# Altium schematic sheet synchronous.SchDoc
size A4; SheetNumber: 3; SheetTotal: 6
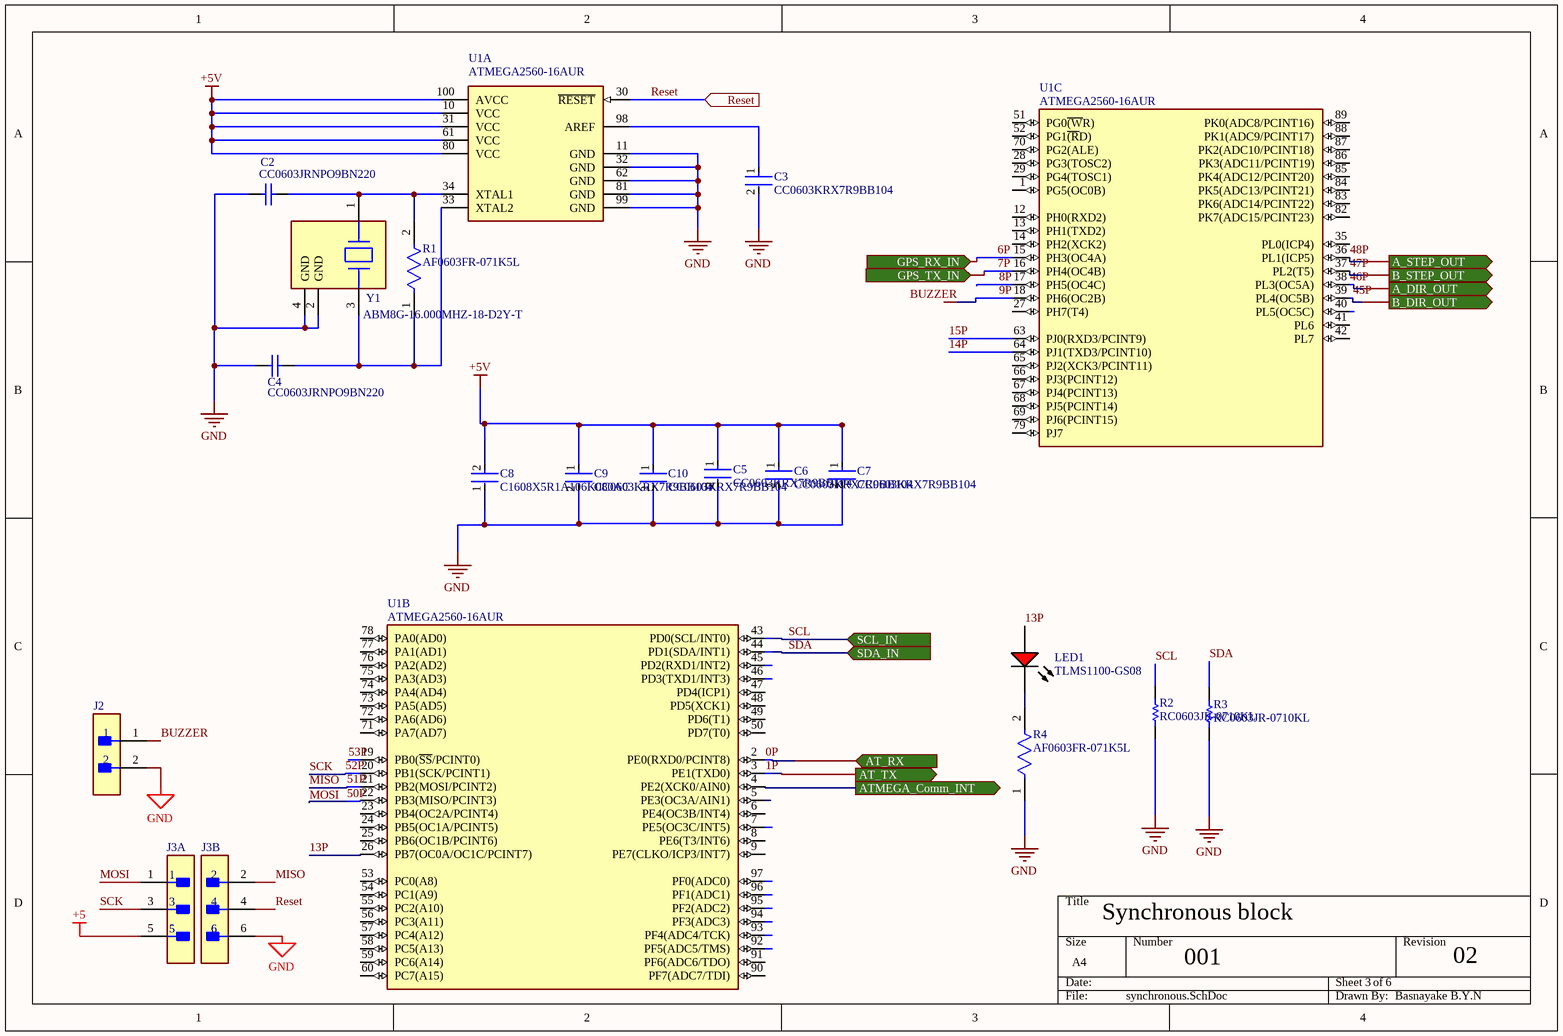
[diagram p0: synchronous.SchDoc]

## Parts
C2  CC0603JRNPO9BN220  [CAPC1608X90X40LL10T20]
C3  CC0603KRX7R9BB104  [FP-CC0603-DA-MFG]
C4  CC0603JRNPO9BN220  [CAPC1608X90X40LL10T20]
C5  CC0603KRX7R9BB104  [FP-CC0603-DA-MFG]
C6  CC0603KRX7R9BB104  [FP-CC0603-DA-MFG]
C7  CC0603KRX7R9BB104  [FP-CC0603-DA-MFG]
C8  C1608X5R1A106K080AC  [FP-C1608-080-0_1-MFG]
C9  CC0603KRX7R9BB104  [FP-CC0603-DA-MFG]
C10  CC0603KRX7R9BB104  [FP-CC0603-DA-MFG]
J2  B2B-XH-A(LF)(SN)  [FP-B2B-XH-A_LF_SN-MFG]  (value not drawn)
J3  M20-9980346  [FP-M20-9980346-MFG]  (value not drawn)  (parts A,B of 2)
LED1  TLMS1100-GS08  [VISH-TLMX1100_V]
R1  AF0603FR-071K5L  [FP-AF0603-IPC_B]
R2  RC0603JR-0710KL  [RESC1608X55X25ML10T15]
R3  RC0603JR-0710KL  [RESC1608X55X25ML10T15]
R4  AF0603FR-071K5L  [FP-AF0603-IPC_B]
U1  ATMEGA2560-16AUR  [FP-100A-MFG]  (parts A,B,C of 3)
Y1  ABM8G-16.000MHZ-18-D2Y-T  [FP-ABM8G-MFG]

## Ports
A_DIR_OUT (out, see Top_domain[3B]), A_STEP_OUT (out, see Top_domain[3B]), AT_RX (in, see Top_domain[2B]), AT_TX (out, see Top_domain[3B]), ATMEGA_Comm_INT (out, see Top_domain[2B]), B_DIR_OUT (out, see Top_domain[3B]), B_STEP_OUT (out, see Top_domain[3B]), GPS_RX_IN (in, see Top_domain[2B]), GPS_TX_IN (in, see Top_domain[2B]), Reset (in), SCL_IN (in, see Top_domain[2B]), SDA_IN (in, see Top_domain[2B])

## Nets
+5: J3.5
+5V: C5.1 C6.1 C7.1 C8.2 C9.1 C10.1 U1.10(VCC) U1.31(VCC) U1.61(VCC) U1.80(VCC) U1.100(AVCC)
GND: C2.1 C3.2 C4.1 C5.2 C6.2 C7.2 C8.1 C9.2 C10.2 J2.2 J3.6 R2.1 R3.1 R4.1 U1.11(GND) U1.32(GND) U1.62(GND) U1.81(GND) U1.99(GND) Y1.2(GND) Y1.4(GND)
0P: U1.2(PE0(RXD0/PCINT8)) ; port AT_RX
1P: U1.3(PE1(TXD0)) ; port AT_TX
6P: U1.15(PH3(OC4A)) ; port GPS_RX_IN
7P: U1.16(PH4(OC4B)) ; port GPS_TX_IN
8P: U1.17(PH5(OC4C))
9P: U1.18(PH6(OC2B))
13P: LED1.1(A) U1.26(PB7(OC0A/OC1C/PCINT7))
14P: U1.64(PJ1(TXD3/PCINT10))
15P: U1.63(PJ0(RXD3/PCINT9))
45P: U1.39(PL4(OC5B)) ; port B_DIR_OUT
46P: U1.38(PL3(OC5A)) ; port A_DIR_OUT
47P: U1.37(PL2(T5)) ; port B_STEP_OUT
48P: U1.36(PL1(ICP5)) ; port A_STEP_OUT
50P: J3.1 U1.22(PB3(MISO/PCINT3))  [also labelled MOSI]
51P: J3.2 U1.21(PB2(MOSI/PCINT2))  [also labelled MISO]
52P: J3.3 U1.20(PB1(SCK/PCINT1))  [also labelled SCK]
53P: U1.19(PB0(~{SS}/PCINT0))
ATMEGA_Comm_INT: U1.4(PE2(XCK0/AIN0)) ; port ATMEGA_Comm_INT
BUZZER: J2.1
Reset: J3.4 U1.30(~{RESET}) ; port Reset
SCL: R2.2 U1.43(PD0(SCL/INT0)) ; port SCL_IN
SDA: R3.2 U1.44(PD1(SDA/INT1)) ; port SDA_IN
NetC2_2: C2.2 R1.2 U1.34(XTAL1) Y1.1
NetC3_1: C3.1 U1.98(AREF)
NetC4_2: C4.2 R1.1 U1.33(XTAL2) Y1.3
NetLED1_2: LED1.2(K) R4.2

Not connected (* = marked no-connect by the designer): U1 1(PG5(OC0B)) 5(PE3(OC3A/AIN1)) 6(PE4(OC3B/INT4)) 7(PE5(OC3C/INT5)) 8(PE6(T3/INT6)) 9(PE7(CLKO/ICP3/INT7)) 12(PH0(RXD2)) 13(PH1(TXD2)) 14(PH2(XCK2)) 23(PB4(OC2A/PCINT4)) 24(PB5(OC1A/PCINT5)) 25(PB6(OC1B/PCINT6)) 27(PH7(T4)) 28(PG3(TOSC2)) 29(PG4(TOSC1)) 35(PL0(ICP4)) 40(PL5(OC5C)) 41(PL6) 42(PL7) 45(PD2(RXD1/INT2)) 46(PD3(TXD1/INT3)) 47(PD4(ICP1)) 48(PD5(XCK1)) 49(PD6(T1)) 50(PD7(T0)) 51(PG0~{(W}R)) 52(PG1~{(R}D)) 53(PC0(A8)) 54(PC1(A9)) 55(PC2(A10)) 56(PC3(A11)) 57(PC4(A12)) 58(PC5(A13)) 59(PC6(A14)) 60(PC7(A15)) 65(PJ2(XCK3/PCINT11)) 66(PJ3(PCINT12)) 67(PJ4(PCINT13)) 68(PJ5(PCINT14)) 69(PJ6(PCINT15)) 70(PG2(ALE)) 71(PA7(AD7)) 72(PA6(AD6)) 73(PA5(AD5)) 74(PA4(AD4)) 75(PA3(AD3)) 76(PA2(AD2)) 77(PA1(AD1)) 78(PA0(AD0)) 79(PJ7) 82(PK7(ADC15/PCINT23)) 83(PK6(ADC14/PCINT22)) 84(PK5(ADC13/PCINT21)) 85(PK4(ADC12/PCINT20)) 86(PK3(ADC11/PCINT19)) 87(PK2(ADC10/PCINT18)) 88(PK1(ADC9/PCINT17)) 89(PK0(ADC8/PCINT16)) 90(PF7(ADC7/TDI)) 91(PF6(ADC6/TDO)) 92(PF5(ADC5/TMS)) 93(PF4(ADC4/TCK)) 94(PF3(ADC3)) 95(PF2(ADC2)) 96(PF1(ADC1)) 97(PF0(ADC0))

## Notes on the sheet
- Synchronous block
- 001
- 3
- 6
- 02
- Basnayake B.Y.N
- Labels drawn without touching a wire or pin: BUZZER

## Library data of the parts
C2 C4 = CMP-1659-00026-1: Chip Capacitor, 22 pF, +/- 5%, 50 V, -55 to 125 degC, 0603 (1608 Metric), RoHS, Tape and Reel; ComponentLink1URL: http://www.yageo.com/; PackageReference: 0603; ComponentLink1Description: Manufacturer URL; PackageDescription: 2-Pin Surface Mount Device, Body 1.6 x 0.8 mm; DatasheetVersion: Rev. 8, 08/2011; ComponentLink2Description: Datasheet; ComponentLink2URL: http://www.yageo.com/documents/recent/UPY-GP_NP0_16V-to-50V_8.pdf
C3 C5-C7 C9 C10 = CMP-2100-03601-2: CAP CER 0.1UF 50V X7R 0603; Manufacturer: YAGEO; Material: Ceramic; Capacitance: 100 nF; Temperature Coefficient: 15%; Tolerance: 0.1; Value: 100 nF; Height: 0.9mm; Voltage: 50 V; ComponentLink2Description: Datasheet; Device Class L2: Capacitors; Temperature Range High: +125°C; Category: Cap; Footprint Url: http://www.yageo.com/exep/pages/download/literatures/UPY-C_GEN_24.pdf; ComponentLink2URL: http://www.yageo.com/documents/recent/UPY-GPHC_X7R_6.3V-to-50V_18.pdf; Package: CC0603-DA; Temperature: -55°C to +125°C; Voltage Rating: 50 V; Temperature Characteristic: X7R; Device Class L1: Passive Components; Temperature Range Low: -55°C; Manufacturer Part Number: CC0603KRX7R9BB104; RoHS: TRUE; Automotive: No; Device Class L3: Ceramic Capacitors; Octopart: https://octopart.com/cc0603krx7r9bb104-yageo-42244635; Mouser Description: Multilayer Ceramic Capacitor, CC Series, 0.1 - F, - 10%, X7R, 50 V, 0603 [1608 Metric]; Lead Free: Yes; Digikey Description: CAP CER 0.1UF 50V X7R 0603
C8 = CMP-2000-04979-3: Multilayer Ceramic Capacitors 10μF ±10% 10V X5R SMD 0603; Capacitance: 10uF; Dielectric Material: Ceramic; Construction: Flat; Height: 0.8mm; Thickness: 0.035inch; Case Code (Metric): 1608; Radiation Hardening: No; Number of Pins: 2; Voltage Rating (DC): 10V; Depth: 0.8mm; Voltage: 10V; RoHS Compliant: Yes; Voltage Rating: 10V; Package Quantity: 1; Resistor Type: Ceramic; Termination: SMD/SMT; Lead Free: Lead Free; REACH SVHC: No SVHC; Tolerance: 10%; Mount: Surface Mount; Series: C; Packaging: Tape and Reel; Width: 0.8mm; Dielectric: X5R; Weight: 7.1E-05oz; Length: 1.6mm; Max Operating Temperature: 85°C; Case Code (Imperial): 0603; Case/Package: 0603; Min Operating Temperature: -55°C
J2 = CMP-2000-05888-3: CONN HEADER VERT 2POS 2.5MM; Current Rating: 3A; Voltage Rating: 250V; Number of Contacts: 2; Contact Resistance: 20mR; Wire/Cable Gauge: 22AWG; Insulation Resistance: 1GR; Connector Type: Male Pin; Packaging: Bulk; Contact Material: Brass; Lead Free: Lead Free; Orientation: Straight; Contact Plating: Tin; Max Current Rating: 3A; Termination: Solder; Fastening Type: Detent; Depth: 5.75mm; Housing Material: Polyamide; REACH SVHC: No SVHC; Series: XH; Voltage Rating (AC): 250V; Number of Positions: 2; Color: Natural; Contact Type: Male Pin; Max Voltage Rating (DC): 250V; Pitch: 2.5mm; Lead Pitch: 2.5mm; Mount: Through Hole; Max Operating Temperature: 85°C; Length: 7.4mm; Max Voltage Rating (AC): 250V; Min Operating Temperature: -25°C; Number of Rows: 1; Housing Color: White
J3 = CMP-2000-06636-2: CONN HEADER VERT 6POS 2.54MM; Manufacturer: Harwin; Current Rating: 3A; Number Of Contacts: 6; Conn Gender: Male; Conn Orientation: Vertical; Device Class L1: Connectors; ComponentLink2Description: Datasheet; Height: 8.99mm; Temperature Range High: +105°C; Contact Material: Tin,Nickel; RoHS: TRUE; Temperature Range Low: -40°C; ComponentLink2URL: https://cdn.harwin.com/pdfs/M20-998.pdf; Digikey Description: CONN HEADER VERT 6POS 2.54MM; Pitch: 2.54mm; Package: M20-9980346; Device Class L2: Headers and Wire Housings; Manufacturer Part Number: M20-9980346; Number Of Rows: 2; Category: Conn; Lead Free: Yes; Mouser Description: 2.54mm (0.1") Pitch DIL Vertical PC Tail Pin Header, 6.1mm mating pin height, tin, 3+3 contacts; Temperature: -40°C to +105°C; Device Class L3: unset; Octopart: https://octopart.com/m20-9980346-harwin-5436545; Automotive: No
LED1 = CMP-1666-00027-1: LED, RED, 2.1 V, -40 to 100 degC, 2-Pin SMD (0603), RoHS, Tape and Reel; Type (Capacitors): C0G; Resistance: 100000000000 Ohm; Capacitance: 12 pF; Voltage Rating: 50 V; Tolerance: 5%; Min Operating Temperature: -55degC; REACH SVHC: No SVHC; ComponentLink2Description: Datasheet; ComponentLink1URL: http://www.vishay.com/; Width: 0.8 mm; Package Quantity: 4000; PackageReference: TLMX1100; ComponentLink2URL: http://www.vishay.com/docs/83173/tlmb1100.pdf; Case/Package: 0603; Case Code (Metric): 1608; Packaging: Tape and Reel; Pins: 2; ComponentLink1Description: Manufacturer URL; Max Operating Temperature: 125degC; Height: 0.8 mm; Length: 1.6 mm; Mount: Surface Mount; PackageDescription: 2-Pin Surface Mount Device, Body 1.6 x 0.8 mm; DatasheetVersion: Rev. 2.7, 03/2016; Case Code (Imperial): 0603; Voltage Rating (DC): 50 V; RoHSCompliant: True; Radiation Hardening: No
R1 R4 = CMP-03412-043191-1: Anti-Sulfurated Chip Resistors Automotive Grade 1.5kΩ 1% 100ppm/°C 0603; Resistance: 1.5kR; Max Power Dissipation: 100mW; Length: 0.063inch; Packaging: Tape and Reel; Tolerance: 1%; RoHS Compliant: Yes; Series: AF; Temperature Coefficient: 100ppm/°C; Case/Package: 0603; Height: 0.022inch; Min Operating Temperature: -55°C; Resistor Type: Thick Film; Features: Moisture Resistant; Width: 0.031inch; Number of Terminations: 2; Max Operating Temperature: 155°C
R2 R3 = CMP-2000-05022-1: Resistor, 10 KOhm, +/- 5%, 100 mW, -55 to 155 degC, 0603 (1608 Metric), RoHS, Tape and Reel; Manufacturer: Yageo; Resistance: 10kOhms; Voltage Rating: 50V; Temperature Coefficient: 100PPM/C; Power Rating: 100mW; Package Reference: 603; Series: RC; Case Code - mm: 1608; Packaging: Reel; Datasheet URL: http://www.farnell.com/datasheets/443971.pdf; Datasheet Version: Rev. 4, 04/2009; Operating Temperature Range: -55Cto+155C; Product: ThickFilmResistorsGeneralPurpose; Package Description: 2-Pin Surface Mount Device, Body 1.6 x 0.8 mm; Manufacturer URL: http://www.yageo.com/; Case Code - in: 0603; Tolerance: 5%; Termination Style: SMD/SMT
U1 = CMP-06276-000073-1: IC MCU 8BIT 256KB FLASH 100TQFP; Oscillator Type: External; Interface: UART; Memory Type: OTP; Memory Size: 8KB; Core Architecture: PIC; Peripherals: POR; Frequency: 16MHz; Number of I/Os: 33; Packaging: Rail/Tube; Max Operating Temperature: 70°C; Case/Package: DIP; Min Operating Temperature: 0°C
Y1 = CMP-2000-05039-3: Crystal 12MHz ±20ppm (Tol) ±30ppm (Stability) 18pF FUND 120Ω 4-Pin SMD T/R; Series Resistance: 120R; Max Operating Temperature: 85°C; Mount: Surface Mount; Width: 2.5mm; Series: ABM8G; Termination: SMD/SMT; Frequency Tolerance: 20ppm; Tolerance: 20ppm; Min Operating Temperature: -40°C; Operating Frequency: 12 MHz; Depth: 2.5mm; Load Capacitance: 18pF; Number of Pins: 4; Length: 3.2mm; Radiation Hardening: No; Frequency Stability: 30ppm; Height: 1mm; Packaging: Tape and Reel; Package Quantity: 1000; ESR (Equivalent Series Resistance): 120R; Lead Free: Lead Free; Frequency: 12MHz; Case/Package: CSMD